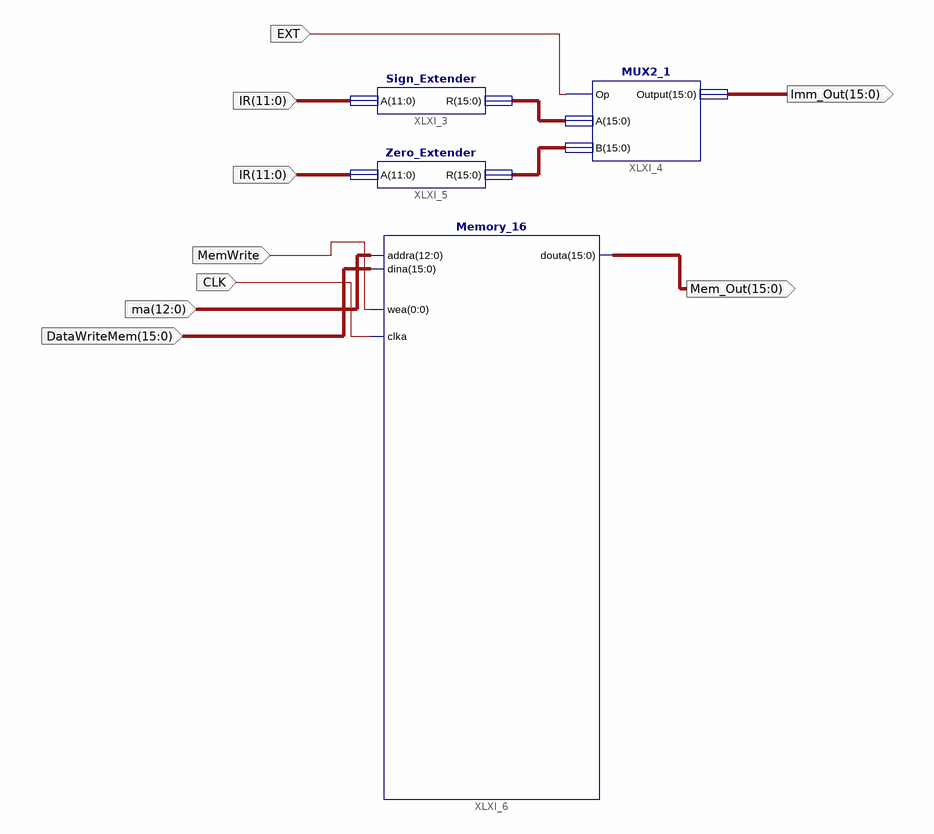
[diagram p0: schematic sheet 1]
// Xilinx ISE schematic PhaseTwo_ImmAndMem.sch (spartan3e) as structural Verilog: 4 symbols, 8 ports
module PhaseTwo_ImmAndMem (
  input  CLK,
  input  MemWrite,
  input  [15:0] DataWriteMem,
  input  EXT,
  input  [11:0] IR,
  input  [12:0] ma,
  output [15:0] Mem_Out,
  output [15:0] Imm_Out
);

  wire [15:0] XLXN_27, XLXN_28;

  Sign_Extender XLXI_3 (.A(IR), .R(XLXN_27));
  MUX2_1 XLXI_4 (.Op(EXT), .A(XLXN_27), .B(XLXN_28), .Output(Imm_Out));
  Zero_Extender XLXI_5 (.A(IR), .R(XLXN_28));
  Memory_16 XLXI_6 (.addra(ma), .dina(DataWriteMem), .wea(MemWrite), .clka(CLK), .douta(Mem_Out));
endmodule
